# EAGLE schematic pcb_top_backup (EAGLE 9.6.2)
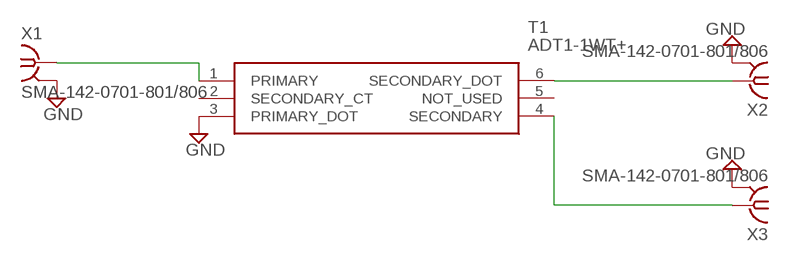
[diagram p0: schematic, sheet 1]

## Parts
T1  ADT1-1WT+  [ADT11WT]
X1  SMA-142-0701-801/806  [J502-ND-142-0701-801/806]
X2  SMA-142-0701-801/806  [J502-ND-142-0701-801/806]
X3  SMA-142-0701-801/806  [J502-ND-142-0701-801/806]

## Nets
GND: T1.3(PRIMARY_DOT) X1.G@1 X1.G@2 X1.G@3 X1.G@4 X2.G@1 X2.G@2 X2.G@3 X2.G@4 X3.G@1 X3.G@2 X3.G@3 X3.G@4
N$1: T1.1(PRIMARY) X1.1
N$2: T1.6(SECONDARY_DOT) X2.1
N$3: T1.4(SECONDARY) X3.1
Unconnected: T1.2(SECONDARY_CT) T1.5(NOT_USED)

## Library data of the parts
T1 = ADT1-1WT+:ADT1-1WT+: RF Transformer Source: Datasheet <https://www.minicircuits.com/pdfs/ADT1-1WT .pdf>; ARROW_PART_NUMBER: ADT1-1WT+; DESCRIPTION: RF Transformer; HEIGHT: 2.84mm; MANUFACTURER_NAME: Mini-Circuits; MANUFACTURER_PART_NUMBER: ADT1-1WT+; MOUSER_PART_NUMBER: 139-ADT1-1WT; MOUSER_PRICE-STOCK: https://www.mouser.co.uk/ProductDetail/Mini-Circuits/ADT1-1WT%2b?qs=xZ%2FP%252Ba9zWqYbLxnb6qhNYw%3D%3D
X1-X3 = con-coax:SMA-: SMA 50 Ohm End Launch Jack Receptacle - Round Contact Johnson Components Source: www.johnsoncomponents.com .. J502-ND.pdf; MF: JOHNSON COMPONENTS; MPN: 142-0701-801; OC_FARNELL: 1608592; OC_NEWARK: 90F2624